# Altium schematic sheet SmartChessMultiplex_SCH.SchDoc
size A
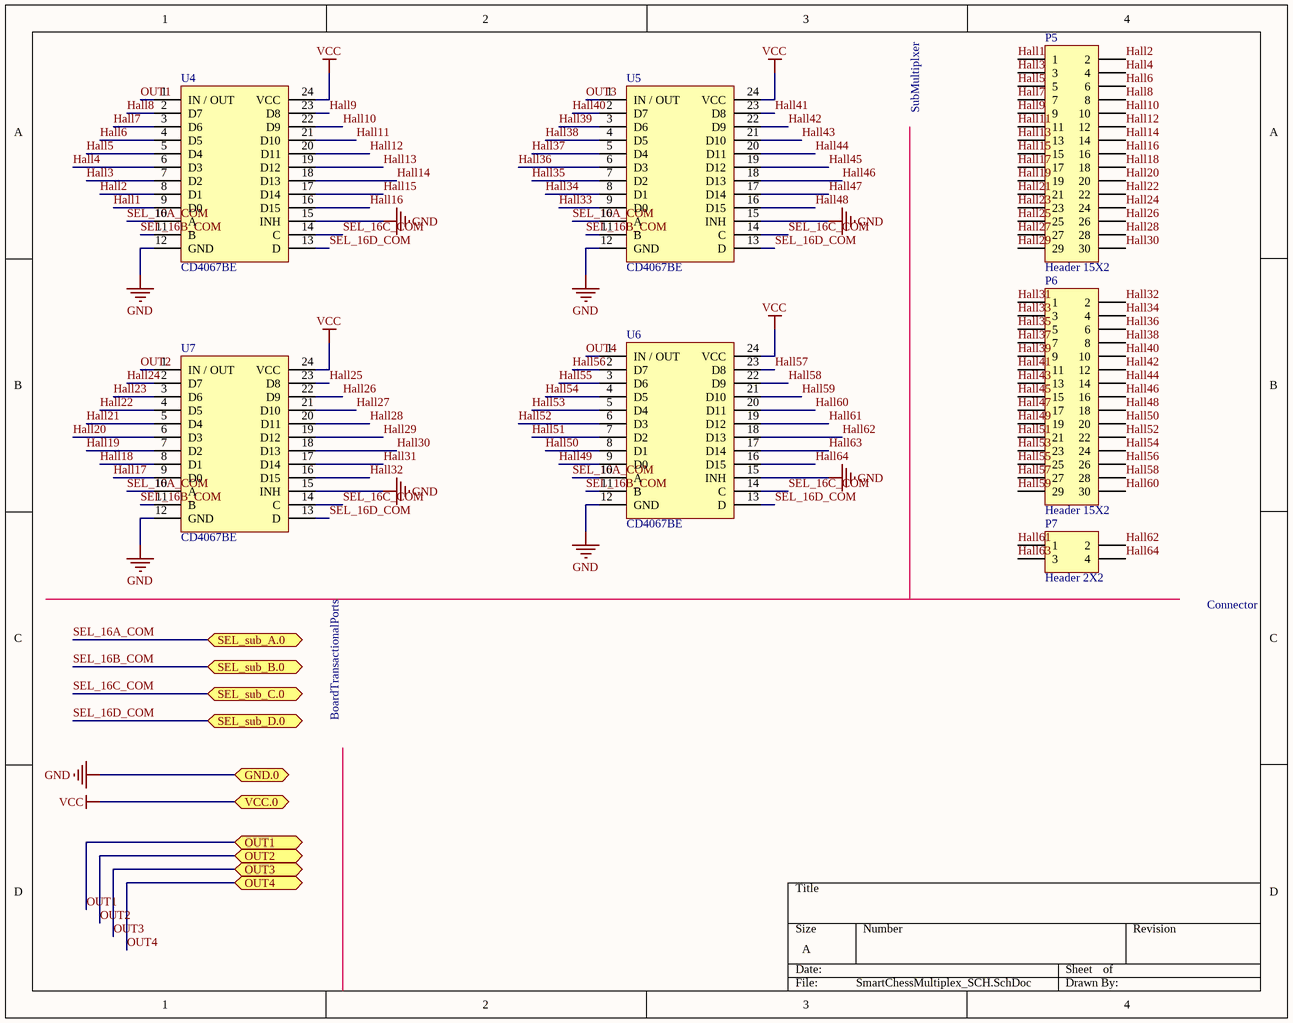
[diagram p0: SmartChessMultiplex_SCH.SchDoc]

## Parts
P5  Header 15X2  [HDR2X15]
P6  Header 15X2  [HDR2X15]
P7  Header 2X2  [HDR2X2]
U4  CD4067BE  [DIP24]
U5  CD4067BE  [DIP24]
U6  CD4067BE  [DIP24]
U7  CD4067BE  [DIP24]

## Ports
GND.0 (bidir), OUT1 (bidir), OUT2 (bidir), OUT3 (bidir), OUT4 (bidir), SEL_sub_A.0 (bidir), SEL_sub_B.0 (bidir), SEL_sub_C.0 (bidir), SEL_sub_D.0 (bidir), VCC.0 (bidir)

## Nets
GND: U4.12(GND) U4.15(INH) U5.12(GND) U5.15(INH) U6.12(GND) U6.15(INH) U7.12(GND) U7.15(INH) ; port GND.0
VCC: U4.24(VCC) U5.24(VCC) U6.24(VCC) U7.24(VCC) ; port VCC.0
Hall1: P5.1 U4.9(D0)
Hall2: P5.2 U4.8(D1)
Hall3: P5.3 U4.7(D2)
Hall4: P5.4 U4.6(D3)
Hall5: P5.5 U4.5(D4)
Hall6: P5.6 U4.4(D5)
Hall7: P5.7 U4.3(D6)
Hall8: P5.8 U4.2(D7)
Hall9: P5.9 U4.23(D8)
Hall10: P5.10 U4.22(D9)
Hall11: P5.11 U4.21(D10)
Hall12: P5.12 U4.20(D11)
Hall13: P5.13 U4.19(D12)
Hall14: P5.14 U4.18(D13)
Hall15: P5.15 U4.17(D14)
Hall16: P5.16 U4.16(D15)
Hall17: P5.17 U7.9(D0)
Hall18: P5.18 U7.8(D1)
Hall19: P5.19 U7.7(D2)
Hall20: P5.20 U7.6(D3)
Hall21: P5.21 U7.5(D4)
Hall22: P5.22 U7.4(D5)
Hall23: P5.23 U7.3(D6)
Hall24: P5.24 U7.2(D7)
Hall25: P5.25 U7.23(D8)
Hall26: P5.26 U7.22(D9)
Hall27: P5.27 U7.21(D10)
Hall28: P5.28 U7.20(D11)
Hall29: P5.29 U7.19(D12)
Hall30: P5.30 U7.18(D13)
Hall31: P6.1 U7.17(D14)
Hall32: P6.2 U7.16(D15)
Hall33: P6.3 U5.9(D0)
Hall34: P6.4 U5.8(D1)
Hall35: P6.5 U5.7(D2)
Hall36: P6.6 U5.6(D3)
Hall37: P6.7 U5.5(D4)
Hall38: P6.8 U5.4(D5)
Hall39: P6.9 U5.3(D6)
Hall40: P6.10 U5.2(D7)
Hall41: P6.11 U5.23(D8)
Hall42: P6.12 U5.22(D9)
Hall43: P6.13 U5.21(D10)
Hall44: P6.14 U5.20(D11)
Hall45: P6.15 U5.19(D12)
Hall46: P6.16 U5.18(D13)
Hall47: P6.17 U5.17(D14)
Hall48: P6.18 U5.16(D15)
Hall49: P6.19 U6.9(D0)
Hall50: P6.20 U6.8(D1)
Hall51: P6.21 U6.7(D2)
Hall52: P6.22 U6.6(D3)
Hall53: P6.23 U6.5(D4)
Hall54: P6.24 U6.4(D5)
Hall55: P6.25 U6.3(D6)
Hall56: P6.26 U6.2(D7)
Hall57: P6.27 U6.23(D8)
Hall58: P6.28 U6.22(D9)
Hall59: P6.29 U6.21(D10)
Hall60: P6.30 U6.20(D11)
Hall61: P7.1 U6.19(D12)
Hall62: P7.2 U6.18(D13)
Hall63: P7.3 U6.17(D14)
Hall64: P7.4 U6.16(D15)
OUT1: U4.1(IN_/_OUT) ; port OUT1
OUT2: U7.1(IN_/_OUT) ; port OUT2
OUT3: U5.1(IN_/_OUT) ; port OUT3
OUT4: U6.1(IN_/_OUT) ; port OUT4
SEL_16A_COM: U4.10(A) U5.10(A) U6.10(A) U7.10(A) ; port SEL_sub_A.0
SEL_16B_COM: U4.11(B) U5.11(B) U6.11(B) U7.11(B) ; port SEL_sub_B.0
SEL_16C_COM: U4.14(C) U5.14(C) U6.14(C) U7.14(C) ; port SEL_sub_C.0
SEL_16D_COM: U4.13(D) U5.13(D) U6.13(D) U7.13(D) ; port SEL_sub_D.0

## Notes on the sheet
- SubMultiplxer
- Connector
- BoardTransactionalPorts

## Library data of the parts
P5 P6 = Header 15X2: Header, 15-Pin, Dual row; LatestRevisionDate: 17-Jul-2002; LatestRevisionNote: Re-released for DXP Platform.; Publisher: Altium Limited
P7 = Header 2X2: Header, 2-Pin, Dual row; LatestRevisionDate: 17-Jul-2002; LatestRevisionNote: Re-released for DXP Platform.; Publisher: Altium Limited